# Altium project audio-hub.PrjPCB
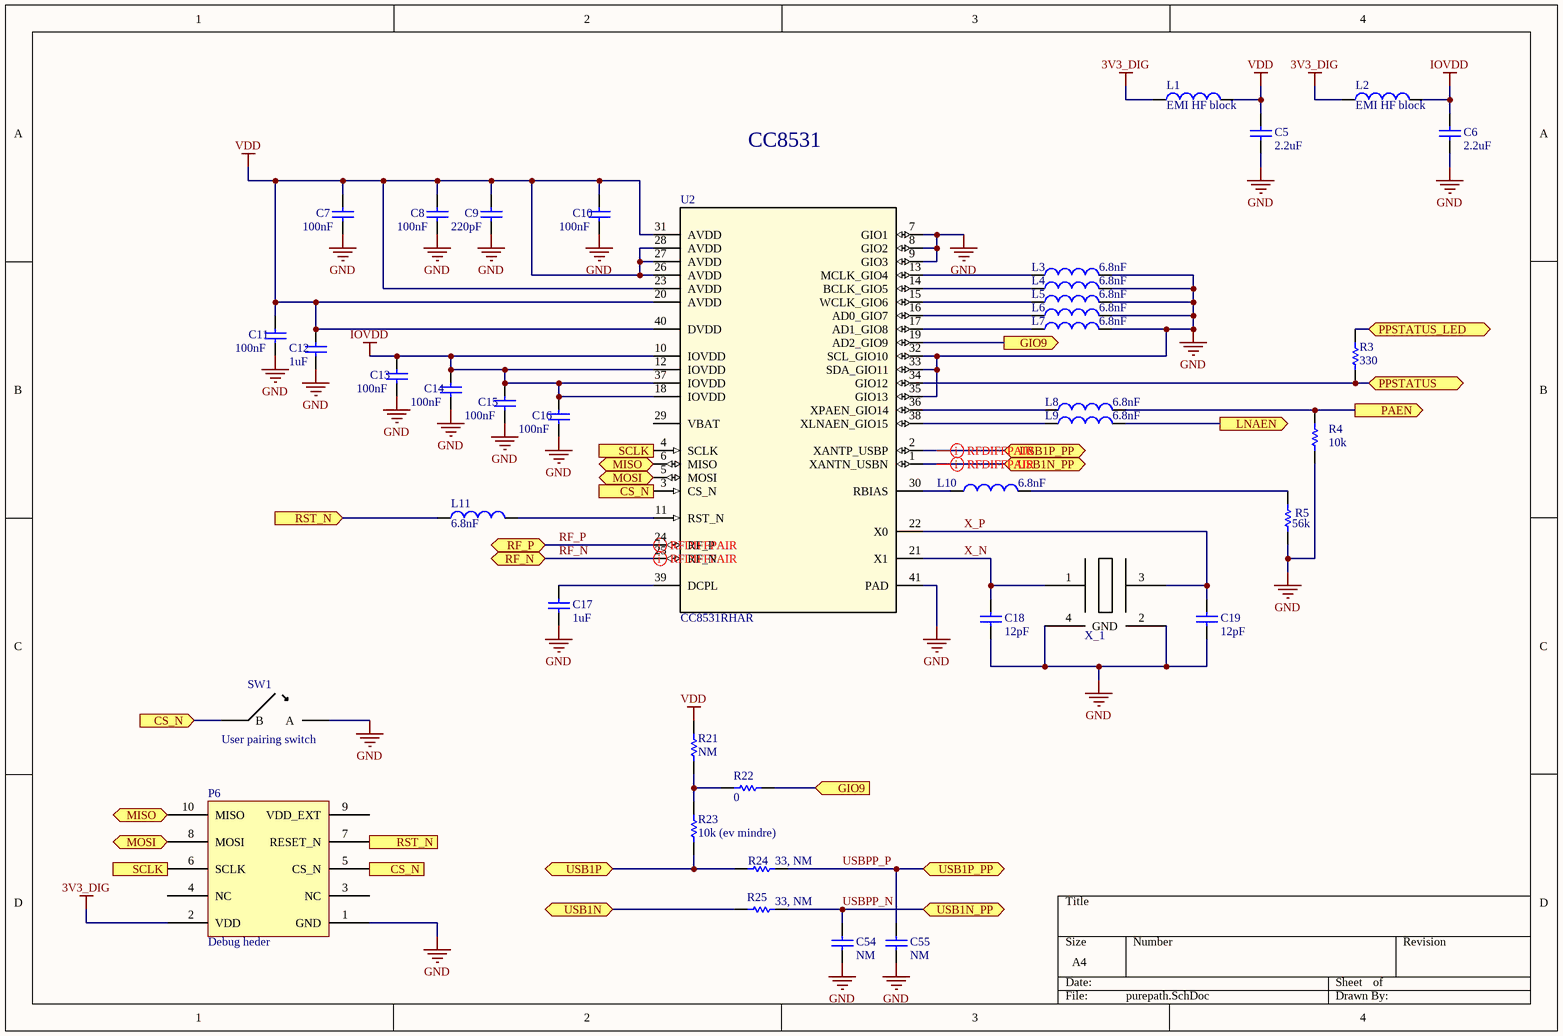
[diagram p0: purepath.SchDoc]
5 sheets, 137 parts. Net scope: flat (ports and power ports of the same name join across sheets).
Board file: layout.PcbDoc
Sheets:
  purepath.SchDoc
  connectors_and_power.SchDoc
  rf_frontend.SchDoc
  audio_usb.SchDoc
  pwr_brk.SchDoc

## Sheet purepath.SchDoc
size A4

### Parts
C5  value 2.2uF  [C_0402]
C6  value 2.2uF  [C_0402]
C7  value 100nF  [C_0402]
C8  value 100nF  [C_0402]
C9  value 220pF  [C_0402]
C10  value 100nF  [C_0402]
C11  value 100nF  [C_0402]
C12  value 1uF  [C_0402]
C13  value 100nF  [C_0402]
C14  value 100nF  [C_0402]
C15  value 100nF  [C_0402]
C16  value 100nF  [C_0402]
C17  value 1uF  [C_0402]
C18  value 12pF  [C_0402]
C19  value 12pF  [C_0402]
C54  value NM  [C_0402]
C55  value NM  [C_0402]
L1  value EMI HF block  [L_0402]  (hidden comment: Inductor)
L2  value EMI HF block  [L_0402]  (hidden comment: Inductor)
L3  value 6.8nF  [L_0402]  (hidden comment: Inductor)
L4  value 6.8nF  [L_0402]  (hidden comment: Inductor)
L5  value 6.8nF  [L_0402]  (hidden comment: Inductor)
L6  value 6.8nF  [L_0402]  (hidden comment: Inductor)
L7  value 6.8nF  [L_0402]  (hidden comment: Inductor)
L8  value 6.8nF  [L_0402]  (hidden comment: Inductor)
L9  value 6.8nF  [L_0402]  (hidden comment: Inductor)
L10  value 6.8nF  [L_0402]  (hidden comment: Inductor)
L11  value 6.8nF  [L_0402]  (hidden comment: Inductor)
P6  Debug heder  [2x5 1.27mm header]
R3  Res1  [R_0402]  (value not drawn)
R4  value 10k  [R_0402]  (hidden comment: Res1)
R5  value 56k  [R_0402]  (hidden comment: Res1)
R21  value NM  [R_0402]  (hidden comment: Res1)
R22  value 0  [R_0402]  (hidden comment: Res1)
R23  value 10k (ev mindre)  [R_0402]  (hidden comment: Res1)
R24  value 33, NM  [R_0402]  (hidden comment: Res1)
R25  value 33, NM  [R_0402]  (hidden comment: Res1)
SW1  User pairing switch  [edge swich]
U2  CC8531RHAR  [RHA0040H]
X_1  X_48  [48Mhz 2x1.6mm SMD]  (value not drawn)

### Ports
CS_N (in), GIO9 (in), GIO9 (out), LNAEN (out), MISO (bidir), MOSI (bidir), PAEN (out), PPSTATUS (bidir), PPSTATUS_LED (bidir), RF_N (bidir), RF_P (bidir), RST_N (in), SCLK (in), SCLK (out), USB1N (bidir), USB1N_PP (bidir), USB1P (bidir), USB1P_PP (bidir)

### Nets
3V3_DIG: L1.1 L2.1 P6.2(VDD)
GND: C5.1 C6.1 C7.1 C8.1 C9.1 C10.1 C11.1 C12.1 C13.2 C14.2 C15.2 C16.2 C17.1 C18.1 C19.1 C54.1 C55.1 L3.2 L4.2 L5.2 L6.2 L7.2 P6.1(GND) R4.1 R5.1 SW1.A U2.7(GIO1) U2.8(GIO2) U2.9(GIO3) U2.32(SCL_GIO10) U2.33(SDA_GIO11) U2.35(GIO13) U2.41(PAD) X_1.2(GND) X_1.4(GND)
IOVDD: C6.2 C13.1 C14.1 C15.1 C16.1 L2.2 U2.10(IOVDD) U2.12(IOVDD) U2.18(IOVDD) U2.37(IOVDD)
VDD: C5.2 C7.2 C8.2 C9.2 C10.2 C11.2 C12.2 L1.2 R21.2 U2.20(AVDD) U2.23(AVDD) U2.26(AVDD) U2.27(AVDD) U2.28(AVDD) U2.31(AVDD) U2.40(DVDD)
RF_N: U2.25(RF_N) ; port RF_N
RF_P: U2.24(RF_P) ; port RF_P
USB2_N: R25.2 ; port USB1N
USB2_P: R23.1 R24.2 ; port USB1P
USBPP_N: C54.2 R25.1 U2.1(XANTN_USBN) ; port USB1N_PP
USBPP_P: C55.2 R24.1 U2.2(XANTP_USBP) ; port USB1P_PP
X_N: C18.2 U2.21(X1) X_1.1
X_P: C19.2 U2.22(X0) X_1.3
NetC17_2: C17.2 U2.39(DCPL)
NetD1_4: R3.2 ; port PPSTATUS_LED
NetL3_1: L3.1 U2.13(MCLK_GIO4)
NetL4_1: L4.1 U2.14(BCLK_GIO5)
NetL5_1: L5.1 U2.15(WCLK_GIO6)
NetL6_1: L6.1 U2.16(AD0_GIO7)
NetL7_1: L7.1 U2.17(AD1_GIO8)
NetL8_1: L8.1 U2.36(XPAEN_GIO14)
NetL8_2: L8.2 R4.2 ; port PAEN
NetL9_1: L9.1 U2.38(XLNAEN_GIO15)
NetL9_2: L9.2 ; port LNAEN
NetL10_1: L10.1 U2.30(RBIAS)
NetL10_2: L10.2 R5.2
NetL11_1: L11.1 P6.7(RESET_N) ; port RST_N
NetL11_2: L11.2 U2.11(RST_N)
NetP6_5: P6.5(CS_N) SW1.B U2.3(CS_N) ; port CS_N
NetP6_6: P6.6(SCLK) U2.4(SCLK) ; port SCLK
NetP6_8: P6.8(MOSI) U2.5(MOSI) ; port MOSI
NetP6_10: P6.10(MISO) U2.6(MISO) ; port MISO
NetR3_1: R3.1 U2.34(GIO12) ; port PPSTATUS
NetR21_1: R21.1 R22.2 R23.2
NetR22_1: R22.1 U2.19(AD2_GIO9) ; port GIO9

Not connected (* = marked no-connect by the designer): P6 3(NC) 4(NC) 9(VDD_EXT); U2 29(VBAT)

### Layout directives
differential pair: RF_N, RF_P, USBPP_N, USBPP_P

### Notes on the sheet
- CC8531
- (in symbol Res1) 330

### Library data of the parts
C5-C19 C54 C55 = Cap
P6 = debug
R3-R5 R21-R25 = Res1: Resistor
SW1 = edge switch
U2 = CC8531RHAR: Imported; Manufacturer: Texas Instruments; PartNumber: CC8531RHAR; RefDes: RefDes; TYPE: TYPE; Value: Value

## Sheet connectors_and_power.SchDoc
size A4
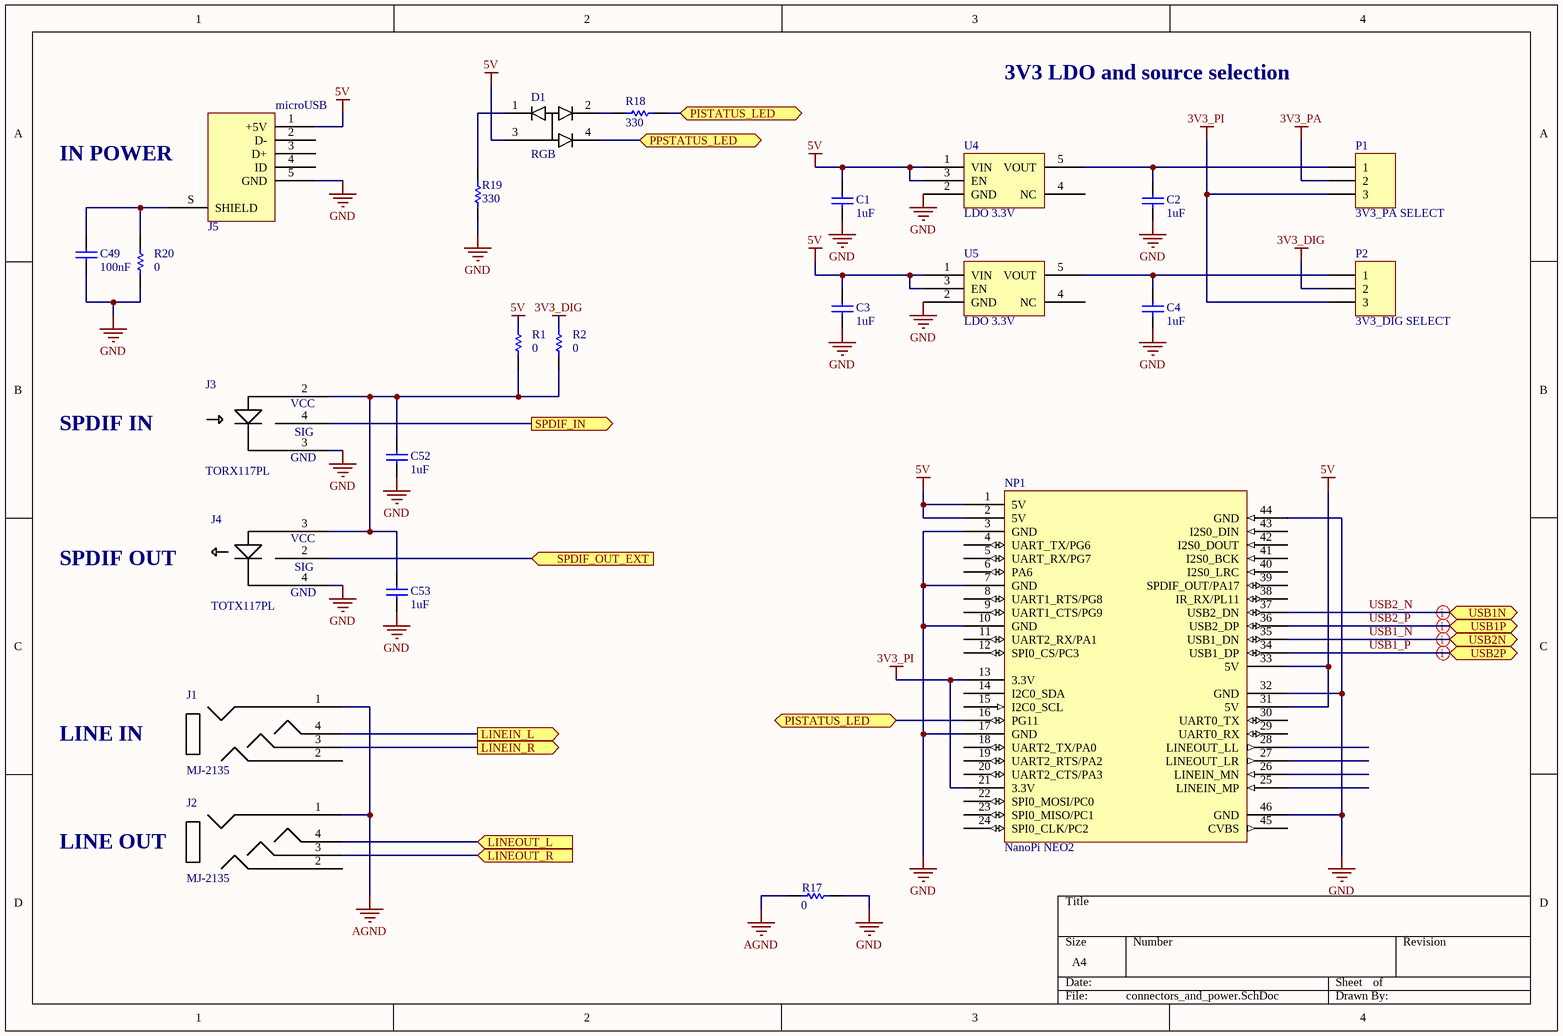
[diagram p1: connectors_and_power.SchDoc]

### Parts
C1  value 1uF  [C_0402]
C2  value 1uF  [C_0402]
C3  value 1uF  [C_0402]
C4  value 1uF  [C_0402]
C49  value 100nF  [C_0402]
C52  value 1uF  [C_0402]
C53  value 1uF  [C_0402]
D1  RGB  [RGB]
J1  MJ-2135  [audio jack]
J2  MJ-2135  [audio jack]
J3  TORX117PL  [TOXX177PL]
J4  TOTX117PL  [TOXX177PL]
J5  Micro USB Jack  [microUSB]  (value not drawn)
NP1  nanopi_neo2  [nanopi_neo2_dock]  (value not drawn)
P1  3V3_PA SELECT  [HDR1X3]
P2  3V3_DIG SELECT  [HDR1X3]
R1  value 0  [R_0402]  (hidden comment: Res1)
R2  value 0  [R_0402]  (hidden comment: Res1)
R17  value 0  [R_0402]  (hidden comment: Res1)
R18  Res1  [R_0402]  (value not drawn)
R19  Res1  [R_0402]  (value not drawn)
R20  value 0  [R_0402]  (hidden comment: Res1)
U4  LDO 3.3V  [SOT95P280X145-5N]
U5  LDO 3.3V  [SOT95P280X145-5N]

### Ports
LINEIN_L (out), LINEIN_R (out), LINEOUT_L (in), LINEOUT_R (in), PISTATUS_LED (bidir), PPSTATUS_LED (bidir), SPDIF_IN (out), SPDIF_OUT_EXT (in), USB1N (bidir), USB1P (bidir), USB2N (bidir), USB2P (bidir)

### Nets
3V3_DIG: P2.2 R2.2
3V3_PA: P1.2
3V3_PI: NP1.13(3.3V) NP1.21(3.3V) P1.3 P2.3
5V: C1.2 C3.2 D1.3(ANODE) J5.1(+5V) NP1.1(5V) NP1.2(5V) NP1.31(5V) NP1.33(5V) R1.2 U4.1(VIN) U4.3(EN) U5.1(VIN) U5.3(EN)
AGND: J1.1 J2.1 R17.2
GND: C1.1 C2.1 C3.1 C4.1 C49.1 C52.1 C53.1 J3.3(GND) J4.4(GND) J5.5(GND) NP1.3(GND) NP1.7(GND) NP1.10(GND) NP1.17(GND) NP1.32(GND) NP1.44(GND) NP1.46(GND) R17.1 R19.1 R20.1 U4.2(GND) U5.2(GND)
USB1_N: NP1.35(USB1_DN) ; port USB2N
USB1_P: NP1.34(USB1_DP) ; port USB2P
USB2_N: NP1.37(USB2_DN) ; port USB1N
USB2_P: NP1.36(USB2_DP) ; port USB1P
NetC2_2: C2.2 P1.1 U4.5(VOUT)
NetC4_2: C4.2 P2.1 U5.5(VOUT)
NetC34_2: J1.4 ; port LINEIN_L
NetC35_2: J2.4 ; port LINEOUT_L
NetC37_2: J1.3 ; port LINEIN_R
NetC38_2: J2.3 ; port LINEOUT_R
NetC49_2: C49.2 J5.S(SHIELD) R20.2
NetC52_2: C52.2 C53.2 J3.2(VCC) J4.3(VCC) R1.1 R2.1
NetD1_1: D1.1(RED) R19.2
NetD1_2: D1.2(GREEN) R18.2
NetD1_4: D1.4(BLUE) ; port PPSTATUS_LED
NetJ3_4: J3.4(SIG) ; port SPDIF_IN
NetJ4_2: J4.2(SIG) ; port SPDIF_OUT_EXT
NetNP1_16: NP1.16(PG11) R18.1 ; port PISTATUS_LED

Not connected (* = marked no-connect by the designer): J1 2; J2 2; J5 2(D-) 3(D+) 4(ID); NP1 4(UART_TX/PG6) 5(UART_RX/PG7) 6(PA6) 8(UART1_RTS/PG8) 9(UART1_CTS/PG9) 11(UART2_RX/PA1) 12(SPI0_CS/PC3) 14(I2C0_SDA) 15(I2C0_SCL) 18(UART2_TX/PA0) 19(UART2_RTS/PA2) 20(UART2_CTS/PA3) 22(SPI0_MOSI/PC0) 23(SPI0_MISO/PC1) 24(SPI0_CLK/PC2) 25(LINEIN_MP) 26(LINEIN_MN) 27(LINEOUT_LR) 28(LINEOUT_LL) 29(UART0_RX) 30(UART0_TX) 38(IR_RX/PL11) 39(SPDIF_OUT/PA17) 40(I2S0_LRC) 41(I2S0_BCK) 42(I2S0_DOUT) 43(I2S0_DIN) 45(CVBS); U4 4(NC); U5 4(NC)

### Layout directives
differential pair: USB1_N, USB1_P, USB2_N, USB2_P

### Notes on the sheet
- 3V3 LDO and source selection
- IN POWER
- SPDIF IN
- SPDIF OUT
- LINE IN
- LINE OUT
- (in symbol Micro USB Jack) microUSB
- (in symbol nanopi_neo2) NanoPi NEO2
- (in symbol Res1) 330

### Library data of the parts
C1-C4 C49 C52 C53 = Cap
J1 J2 = MJ-2135: 3.5mm Audio jack
J5 = Micro USB Jack: Molex micro USB AB  47589-0001
NP1 = nanopi_neo2: Flipped NanoPi NEO2 dock
P1 P2 = Header 3: Header, 3-Pin; LatestRevisionDate: 17-Jul-2002; LatestRevisionNote: Re-released for DXP Platform.; Publisher: Altium Limited
R1 R2 R17-R20 = Res1: Resistor

## Sheet rf_frontend.SchDoc
size A4
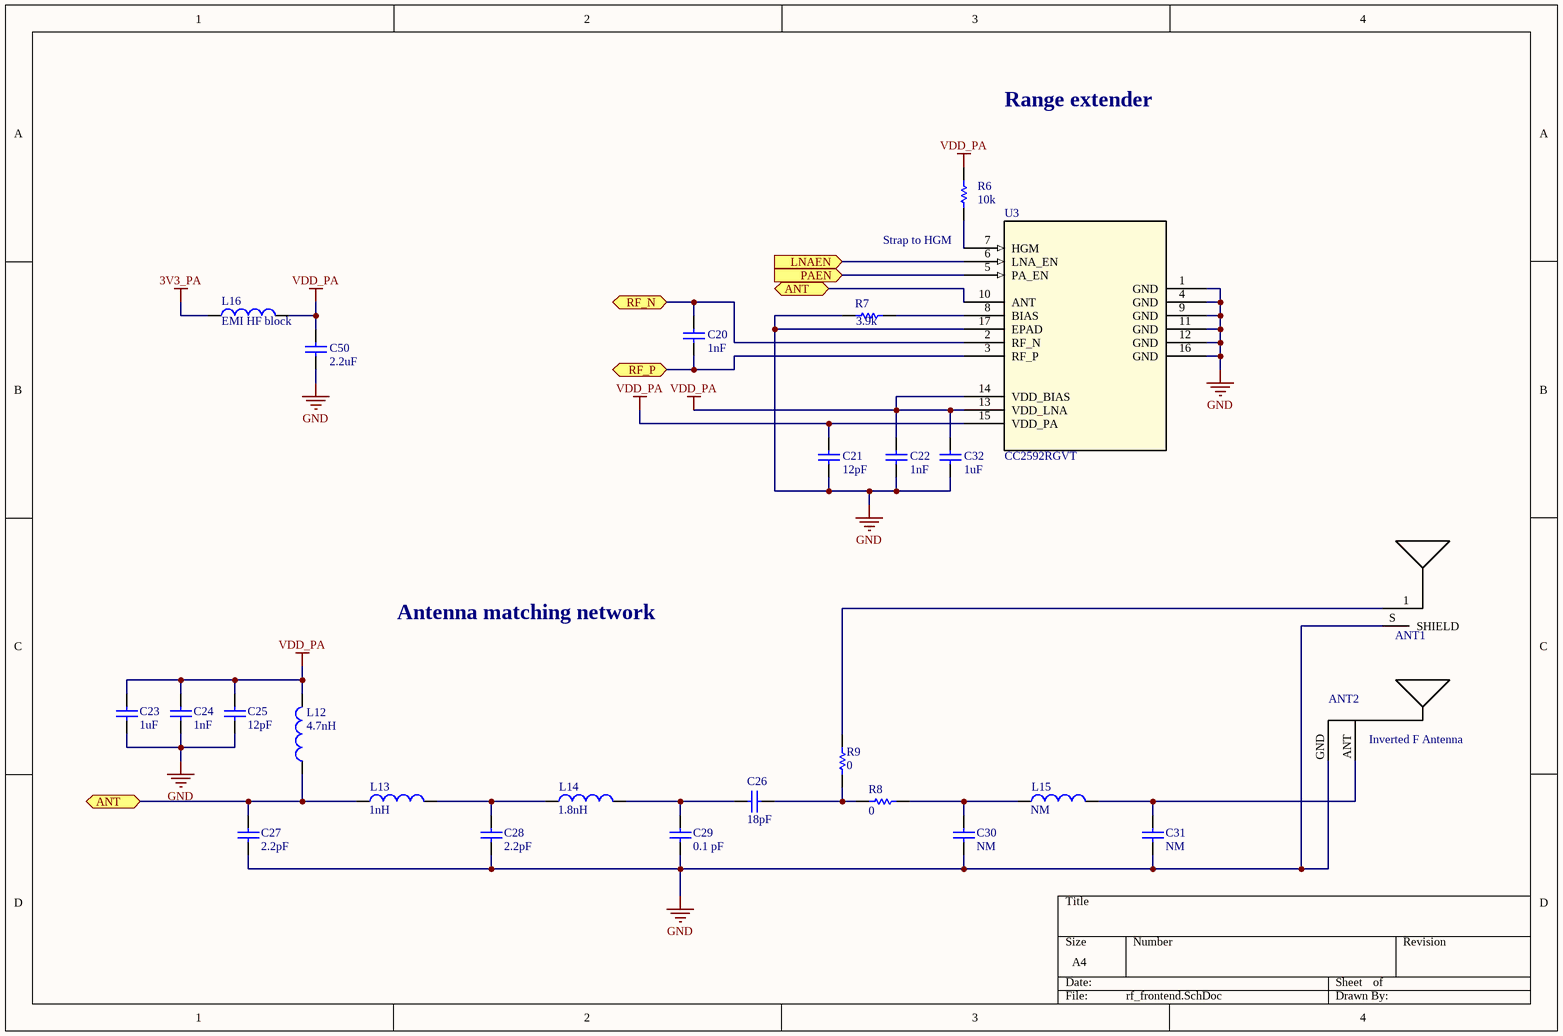
[diagram p2: rf_frontend.SchDoc]

### Parts
ANT1  SMA RP Antenna  [SMA ANTENNA]  (value not drawn)
ANT2  Inverted F ANT  [INVERTED_F_ANT]  (value not drawn)
C20  value 1nF  [C_0402]
C21  value 12pF  [C_0402]
C22  value 1nF  [C_0402]
C23  value 1uF  [C_0402_RF_IN_OUT]
C24  value 1nF  [C_0402_RF_IN_OUT]
C25  value 12pF  [C_0402_RF_IN_OUT]
C26  value 18pF  [C_0402_RF_IN]
C27  value 2.2pF  [C_0402_RF_IN_OUT]
C28  value 2.2pF  [C_0402_RF_IN_OUT]
C29  value 0.1 pF  [C_0402_RF_IN_OUT]
C30  value NM  [C_0402_RF_IN_OUT]
C31  value NM  [C_0402_RF_IN_OUT]
C32  value 1uF  [C_0402]
C50  value 2.2uF  [C_0402]
L12  value 4.7nH  [R_0402_IN_OUT]  (hidden comment: Inductor)
L13  value 1nH  [L_0402_RF_IN]  (hidden comment: Inductor)
L14  value 1.8nH  [L_0402_RF_IN]  (hidden comment: Inductor)
L15  value NM  [L_0402_RF_IN]  (hidden comment: Inductor)
L16  value EMI HF block  [L_0402]  (hidden comment: Inductor)
R6  value 10k  [R_0402]  (hidden comment: Res1)
R7  value 3.9k  [R_0402]  (hidden comment: Res1)
R8  value 0  [R_0402_IN_OUT]  (hidden comment: Res1)
R9  value 0  [R_0402_IN]  (hidden comment: Res1)
U3  CC2592RGVT  [RGV16_2P16X2P16]

### Ports
ANT (bidir), LNAEN (in), PAEN (in), RF_N (bidir), RF_P (bidir)

### Nets
3V3_PA: L16.1
GND: ANT1.S(SHIELD) ANT2.GND C21.1 C22.1 C23.2 C24.2 C25.2 C27.2 C28.2 C29.2 C30.2 C31.2 C32.1 C50.1 R7.2 U3.1(GND) U3.4(GND) U3.9(GND) U3.11(GND) U3.12(GND) U3.16(GND) U3.17(EPAD)
VDD_PA: C21.2 C22.2 C23.1 C24.1 C25.1 C32.2 C50.2 L12.2 L16.2 R6.2 U3.13(VDD_LNA) U3.14(VDD_BIAS) U3.15(VDD_PA)
RF_N: C20.2 U3.2(RF_N) ; port RF_N
RF_P: C20.1 U3.3(RF_P) ; port RF_P
NetANT1_1: ANT1.1(FEED) R9.1
NetANT2_ANT: ANT2.ANT C31.1 L15.2
NetC26_1: C26.1 R8.1 R9.2
NetC26_2: C26.2 C29.1 L14.2
NetC27_1: C27.1 L12.1 L13.1 U3.10(ANT) ; port ANT
NetC28_1: C28.1 L13.2 L14.1
NetC30_1: C30.1 L15.1 R8.2
NetL8_2: U3.5(PA_EN) ; port PAEN
NetL9_2: U3.6(LNA_EN) ; port LNAEN
NetR6_1: R6.1 U3.7(HGM)
NetR7_1: R7.1 U3.8(BIAS)

### Notes on the sheet
- Range extender
- (near R6) Strap to HGM
- Antenna matching network
- (in symbol Inverted F ANT) Inverted F Antenna

### Library data of the parts
C20-C32 C50 = Cap
R6-R9 = Res1: Resistor
U3 = CC2592RGVT: Imported; Built_By: EMA_UL_Team; Vendor: Texas Instruments; Manufacturer_Part_Number: CC2592RGVT; RefDes: RefDes; Type: DEV; Value: Value

## Sheet audio_usb.SchDoc
size A4
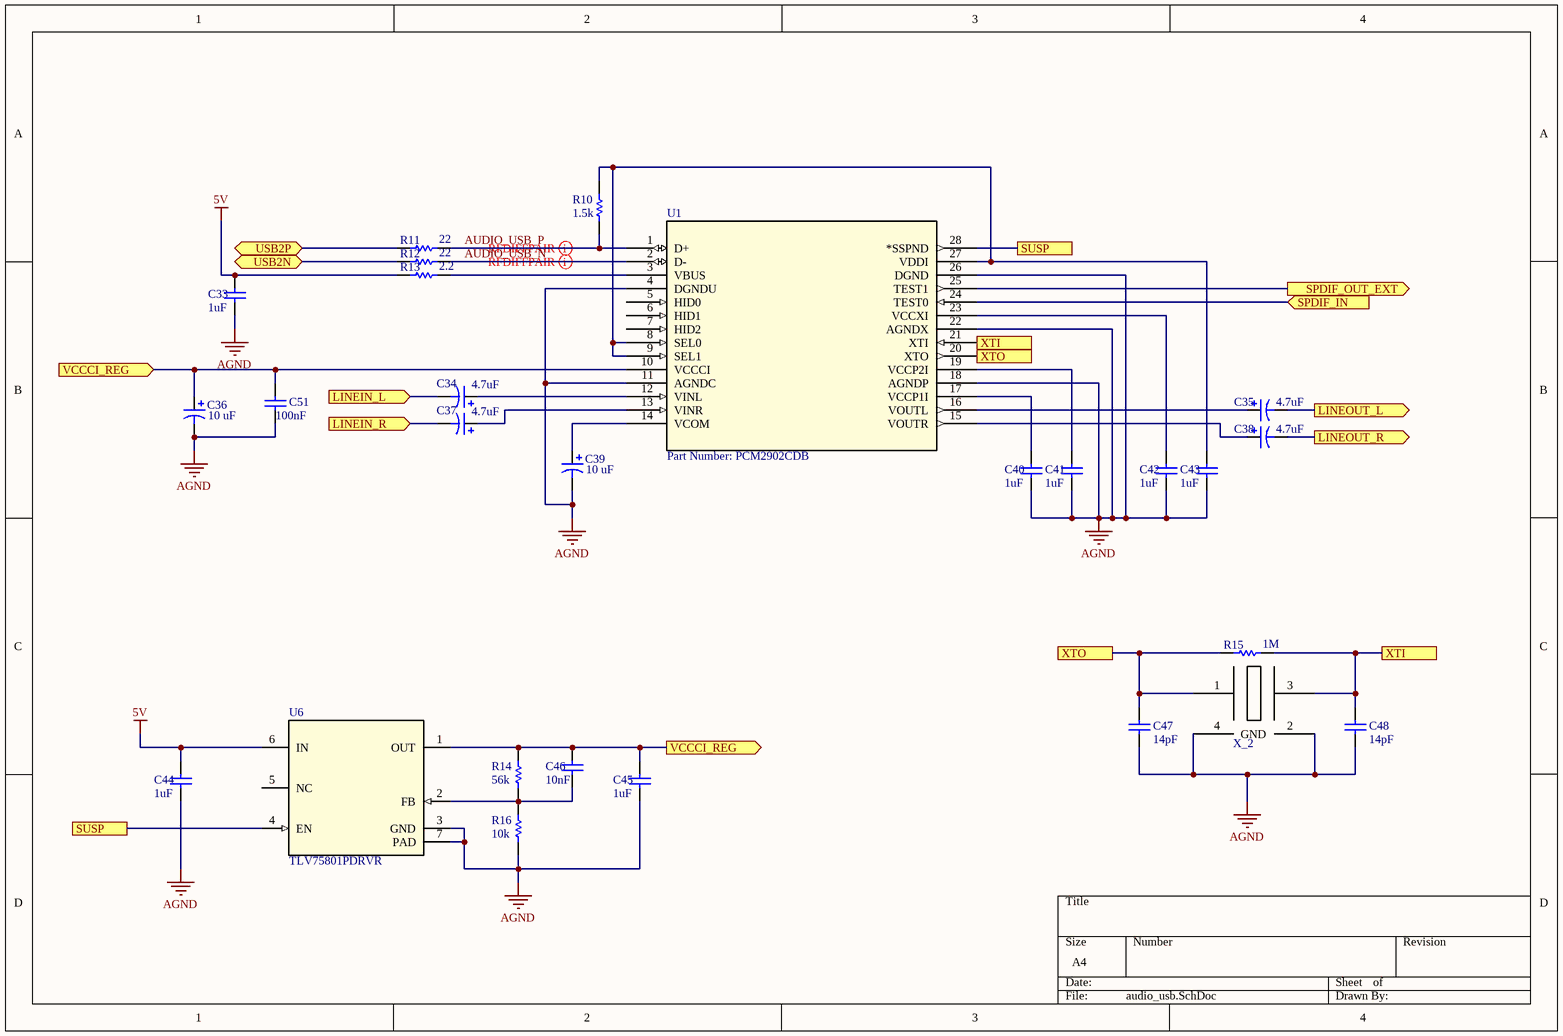
[diagram p3: audio_usb.SchDoc]

### Parts
C33  value 1uF  [C_0402]
C34  value 4.7uF  [CAPAE5453X54M]  (hidden comment: Cap Pol1)
C35  value 4.7uF  [CAPAE5453X54M]  (hidden comment: Cap Pol1)
C36  value 10 uF  [CAPAE5453X54M]  (hidden comment: Cap Pol1)
C37  value 4.7uF  [CAPAE5453X54M]  (hidden comment: Cap Pol1)
C38  value 4.7uF  [CAPAE5453X54M]  (hidden comment: Cap Pol1)
C39  value 10 uF  [CAPAE5453X54M]  (hidden comment: Cap Pol1)
C40  value 1uF  [C_0402]
C41  value 1uF  [C_0402]
C42  value 1uF  [C_0402]
C43  value 1uF  [C_0402]
C44  value 1uF  [C_0402]
C45  value 1uF  [C_0402]
C46  value 10nF  [C_0402]
C47  value 14pF  [C_0402]
C48  value 14pF  [C_0402]
C51  value 100nF  [C_0402]
R10  value 1.5k  [R_0402]  (hidden comment: Res1)
R11  value 22  [R_0402]  (hidden comment: Res1)
R12  value 22  [R_0402]  (hidden comment: Res1)
R13  value 2.2  [R_0402]  (hidden comment: Res1)
R14  value 56k  [R_0402]  (hidden comment: Res1)
R15  value 1M  [R_0402]  (hidden comment: Res1)
R16  value 10k  [R_0402]  (hidden comment: Res1)
U1  Part Number: PCM2902CDB  [SOP65P780X200-28N]
U6  TLV75801PDRVR  [DRV0006A]
X_2  X_48  [48Mhz 2x1.6mm SMD]  (value not drawn)

### Ports
LINEIN_L (in), LINEIN_R (in), LINEOUT_L (out), LINEOUT_R (out), SPDIF_IN (in), SPDIF_OUT_EXT (out), SUSP, USB2N (bidir), USB2P (bidir), VCCCI_REG (in), VCCCI_REG (out), XTI, XTO

### Nets
5V: C33.2 C44.2 R13.1 U6.6(IN)
AGND: C33.1 C36.2 C39.2 C40.1 C41.1 C42.1 C43.1 C44.1 C45.1 C47.1 C48.1 C51.1 R16.1 U1.4(DGNDU) U1.11(AGNDC) U1.18(AGNDP) U1.22(AGNDX) U1.26(DGND) U6.3(GND) U6.7(PAD) X_2.2(GND) X_2.4(GND)
AUDIO_USB_N: R12.2 U1.2(D-)
AUDIO_USB_P: R10.1 R11.2 U1.1(D+)
USB1_N: R12.1 ; port USB2N
USB1_P: R11.1 ; port USB2P
NetC34_1: C34.1 U1.12(VINL)
NetC34_2: C34.2 ; port LINEIN_L
NetC35_1: C35.1 U1.16(VOUTL)
NetC35_2: C35.2 ; port LINEOUT_L
NetC36_1: C36.1 C45.2 C46.2 C51.2 R14.2 U1.10(VCCCI) U6.1(OUT) ; port VCCCI_REG
NetC37_1: C37.1 U1.13(VINR)
NetC37_2: C37.2 ; port LINEIN_R
NetC38_1: C38.1 U1.15(VOUTR)
NetC38_2: C38.2 ; port LINEOUT_R
NetC39_1: C39.1 U1.14(VCOM)
NetC40_2: C40.2 U1.17(VCCP1I)
NetC41_2: C41.2 U1.19(VCCP2I)
NetC42_2: C42.2 U1.23(VCCXI)
NetC43_2: C43.2 R10.2 U1.8(SEL0) U1.9(SEL1) U1.27(VDDI)
NetC46_1: C46.1 R14.1 R16.2 U6.2(FB)
NetC47_2: C47.2 R15.1 U1.20(XTO) X_2.1 ; port XTO
NetC48_2: C48.2 R15.2 U1.21(XTI) X_2.3 ; port XTI
NetJ3_4: U1.24(TEST0) ; port SPDIF_IN
NetJ4_2: U1.25(TEST1) ; port SPDIF_OUT_EXT
NetR13_2: R13.2 U1.3(VBUS)
NetU1_28: U1.28(*SSPND) U6.4(EN) ; port SUSP

Not connected (* = marked no-connect by the designer): U1 5(HID0) 6(HID1) 7(HID2); U6 5(NC)

### Layout directives
differential pair: AUDIO_USB_N, AUDIO_USB_P

### Library data of the parts
C33 C40-C48 C51 = Cap
C34-C39 = Cap Pol1: Polarized Capacitor (Radial)
R10-R16 = Res1: Resistor
U1 = PCM2902CDB: No Description Available; Manufacturer: Texas Instruments; Built_By: EMA_UL_Team; Vendor: Texas Instruments; Manufacturer_Part_Number: PCM2902CDB; Copyright: Copyright (C) 2018 Accelerated Designs. All rights reserved; RefDes: RefDes; Type: DEV; Value: Value
U6 = TLV75801PDRVR: Imported; Manufacturer: Texas Instruments; PartNumber: TLV75801PDRVR; RefDes: RefDes; TYPE: TYPE; Value: Value

## Sheet pwr_brk.SchDoc
size A4
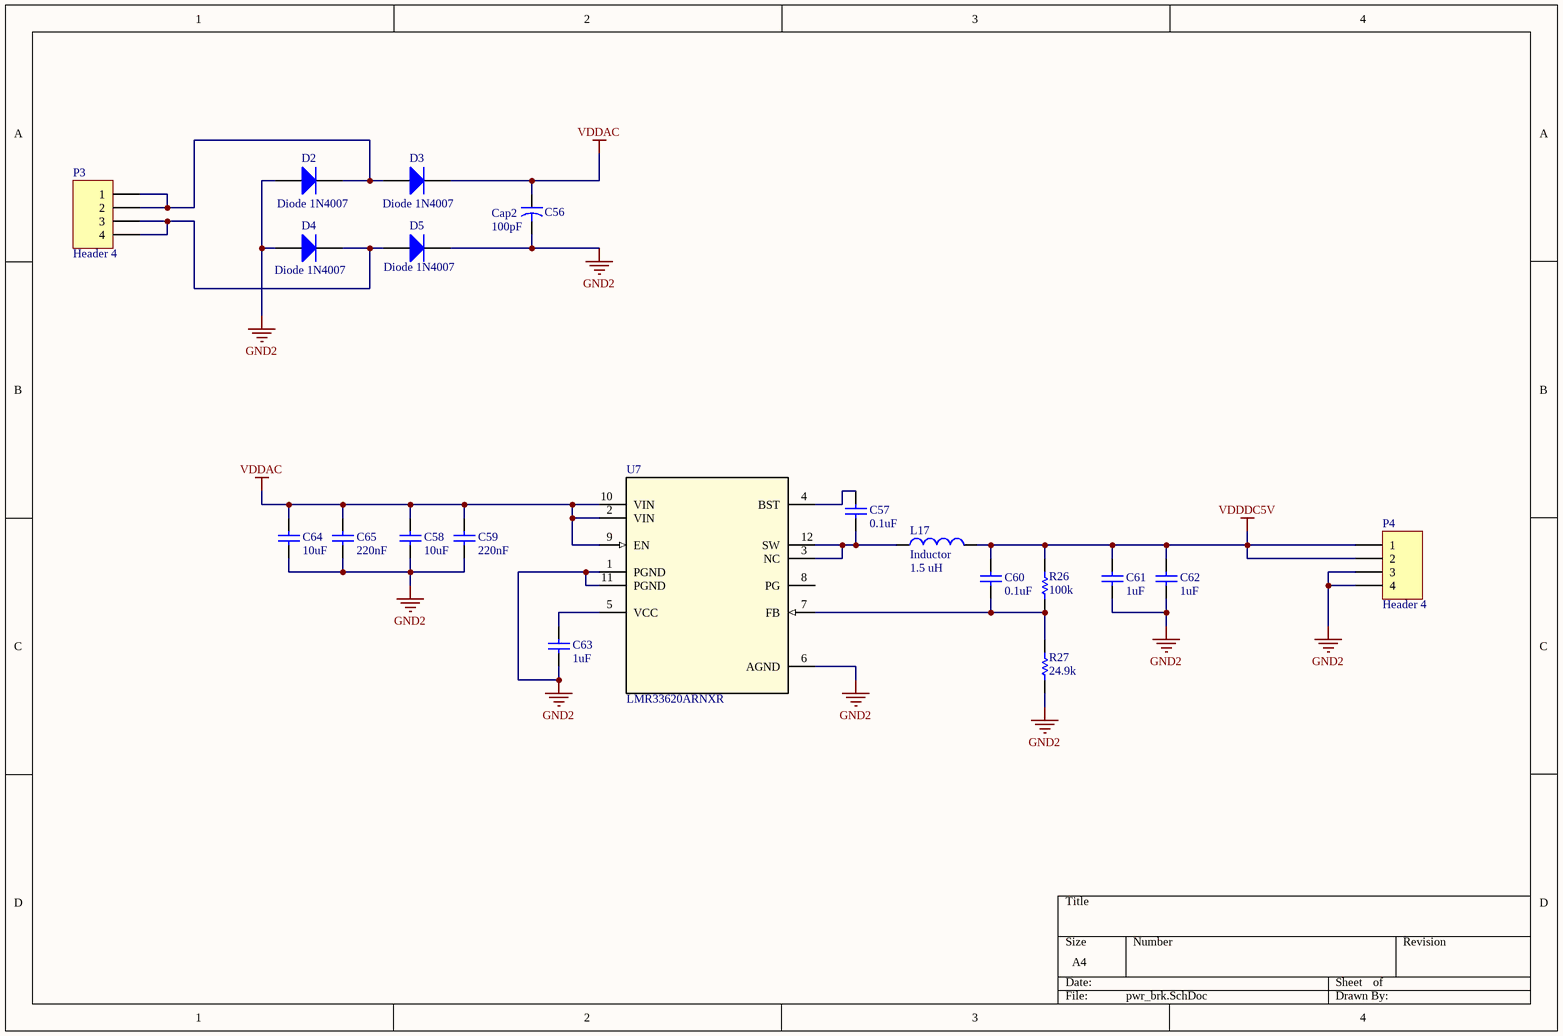
[diagram p4: pwr_brk.SchDoc]

### Parts
C56  Cap2  value 100pF  [CAPR5-4X5]
C57  value 0.1uF  [C_0402]
C58  value 10uF  [CAPC1608X05N]
C59  value 220nF  [C_0402]
C60  value 0.1uF  [C_0402]
C61  value 1uF  [CAPC1608X05N]
C62  value 1uF  [CAPC1608X05N]
C63  value 1uF  [C_0402]
C64  value 10uF  [CAPC1608X05N]
C65  value 220nF  [C_0402]
D2  Diode 1N4007  [DO-41]
D3  Diode 1N4007  [DO-41]
D4  Diode 1N4007  [DO-41]
D5  Diode 1N4007  [DO-41]
L17  Inductor  value 1.5 uH  [INDC2016X10N]
P3  Header 4  [HDR1X4]
P4  Header 4  [HDR1X4]
R26  Res1  [R_0402]  (value not drawn)
R27  Res1  [R_0402]  (value not drawn)
U7  LMR33620ARNXR  [RNX0012B]

### Nets
GND2: C56.2 C58.1 C59.1 C61.1 C62.1 C63.1 C64.1 C65.1 D2.1(A) D4.1(A) D5.2(K) P4.3 P4.4 R27.2 U7.1(PGND) U7.6(AGND) U7.11(PGND)
VDDAC: C56.1 C58.2 C59.2 C64.2 C65.2 D3.2(K) U7.2(VIN) U7.9(EN) U7.10(VIN)
VDDDC5V: C60.2 C61.2 C62.2 L17.2 P4.1 P4.2 R26.1
NetC57_1: C57.1 L17.1 U7.3(NC) U7.12(SW)
NetC57_2: C57.2 U7.4(BST)
NetC60_1: C60.1 R26.2 R27.1 U7.7(FB)
NetC63_2: C63.2 U7.5(VCC)
NetD2_2: D2.2(K) D3.1(A) P3.1 P3.2
NetD4_2: D4.2(K) D5.1(A) P3.3 P3.4

Not connected (* = marked no-connect by the designer): U7 8(PG)

### Notes on the sheet
- (in symbol Res1) 100k; 24.9k

### Library data of the parts
C56 = Cap2: Capacitor; Published: 23-Sep-2002; PackageReference: CAPR5-4X5; Publisher: Altium Limited; PackageDescription: Capacitor; 2 Leads
C57-C65 = Cap
D2-D5 = Diode 1N4007: 1 Amp General Purpose Rectifier; Published: 8-Jun-2000; LatestRevisionDate: 17-Jul-2002; LatestRevisionNote: Re-released for DXP Platform.; DatasheetVersion: 1998; PackageVersion: Aug-1999; PackageReference: DO-41; Publisher: Altium Limited; PackageDescription: Diode, Axial; Body 5.2 x 2.7 mm (LxDia. max), Lead Dia. 0.86 mm (max); Code_JEDEC: DO-204-AL; ComponentLink1Description: Manufacturer Link; ComponentLink1URL: http://www.fairchildsemi.com/; ComponentLink2Description: Datasheet; ComponentLink2URL: http://www.fairchildsemi.com/ds/1N%2F1N4001.pdf
L17 = Inductor: Code_IEC: 1005; Published: 8-Jun-2000; LatestRevisionDate: 29-May-2009; LatestRevisionNote: IPC-7351 Footprint Added.; PackageReference: 0402-A; Publisher: Altium Limited; PackageDescription: Chip Inductor; Code_JEITA: 0402
P3 P4 = Header 4: Header, 4-Pin; LatestRevisionDate: 17-Jul-2002; LatestRevisionNote: Re-released for DXP Platform.; Publisher: Altium Limited
R26 R27 = Res1: Resistor
U7 = LMR33620ARNXR: Imported; Manufacturer: Texas Instruments; PartNumber: LMR33620ARNXR; RefDes: RefDes; TYPE: TYPE; Value: Value

## Nets that join several sheets
3V3_DIG: purepath (L1.1 L2.1 P6.2), connectors_and_power (P2.2 R2.2)
3V3_PA: connectors_and_power (P1.2), rf_frontend (L16.1)
5V: connectors_and_power (13 pins), audio_usb (C33.2 C44.2 R13.1 U6.6)
AGND: connectors_and_power (J1.1 J2.1 R17.2), audio_usb (22 pins)
GND: purepath (35 pins), connectors_and_power (22 pins), rf_frontend (22 pins)
NetC34_2: connectors_and_power (J1.4), audio_usb (C34.2)
NetC35_2: connectors_and_power (J2.4), audio_usb (C35.2)
NetC37_2: connectors_and_power (J1.3), audio_usb (C37.2)
NetC38_2: connectors_and_power (J2.3), audio_usb (C38.2)
NetD1_4: purepath (R3.2), connectors_and_power (D1.4)
NetJ3_4: connectors_and_power (J3.4), audio_usb (U1.24)
NetJ4_2: connectors_and_power (J4.2), audio_usb (U1.25)
NetL8_2: purepath (L8.2 R4.2), rf_frontend (U3.5)
NetL9_2: purepath (L9.2), rf_frontend (U3.6)
RF_N: purepath (U2.25), rf_frontend (C20.2 U3.2)
RF_P: purepath (U2.24), rf_frontend (C20.1 U3.3)
USB1_N: connectors_and_power (NP1.35), audio_usb (R12.1)
USB1_P: connectors_and_power (NP1.34), audio_usb (R11.1)
USB2_N: purepath (R25.2), connectors_and_power (NP1.37)
USB2_P: purepath (R23.1 R24.2), connectors_and_power (NP1.36)